# EAGLE design AudioMega HaGeHa DIL v101 (EAGLE 6.3)
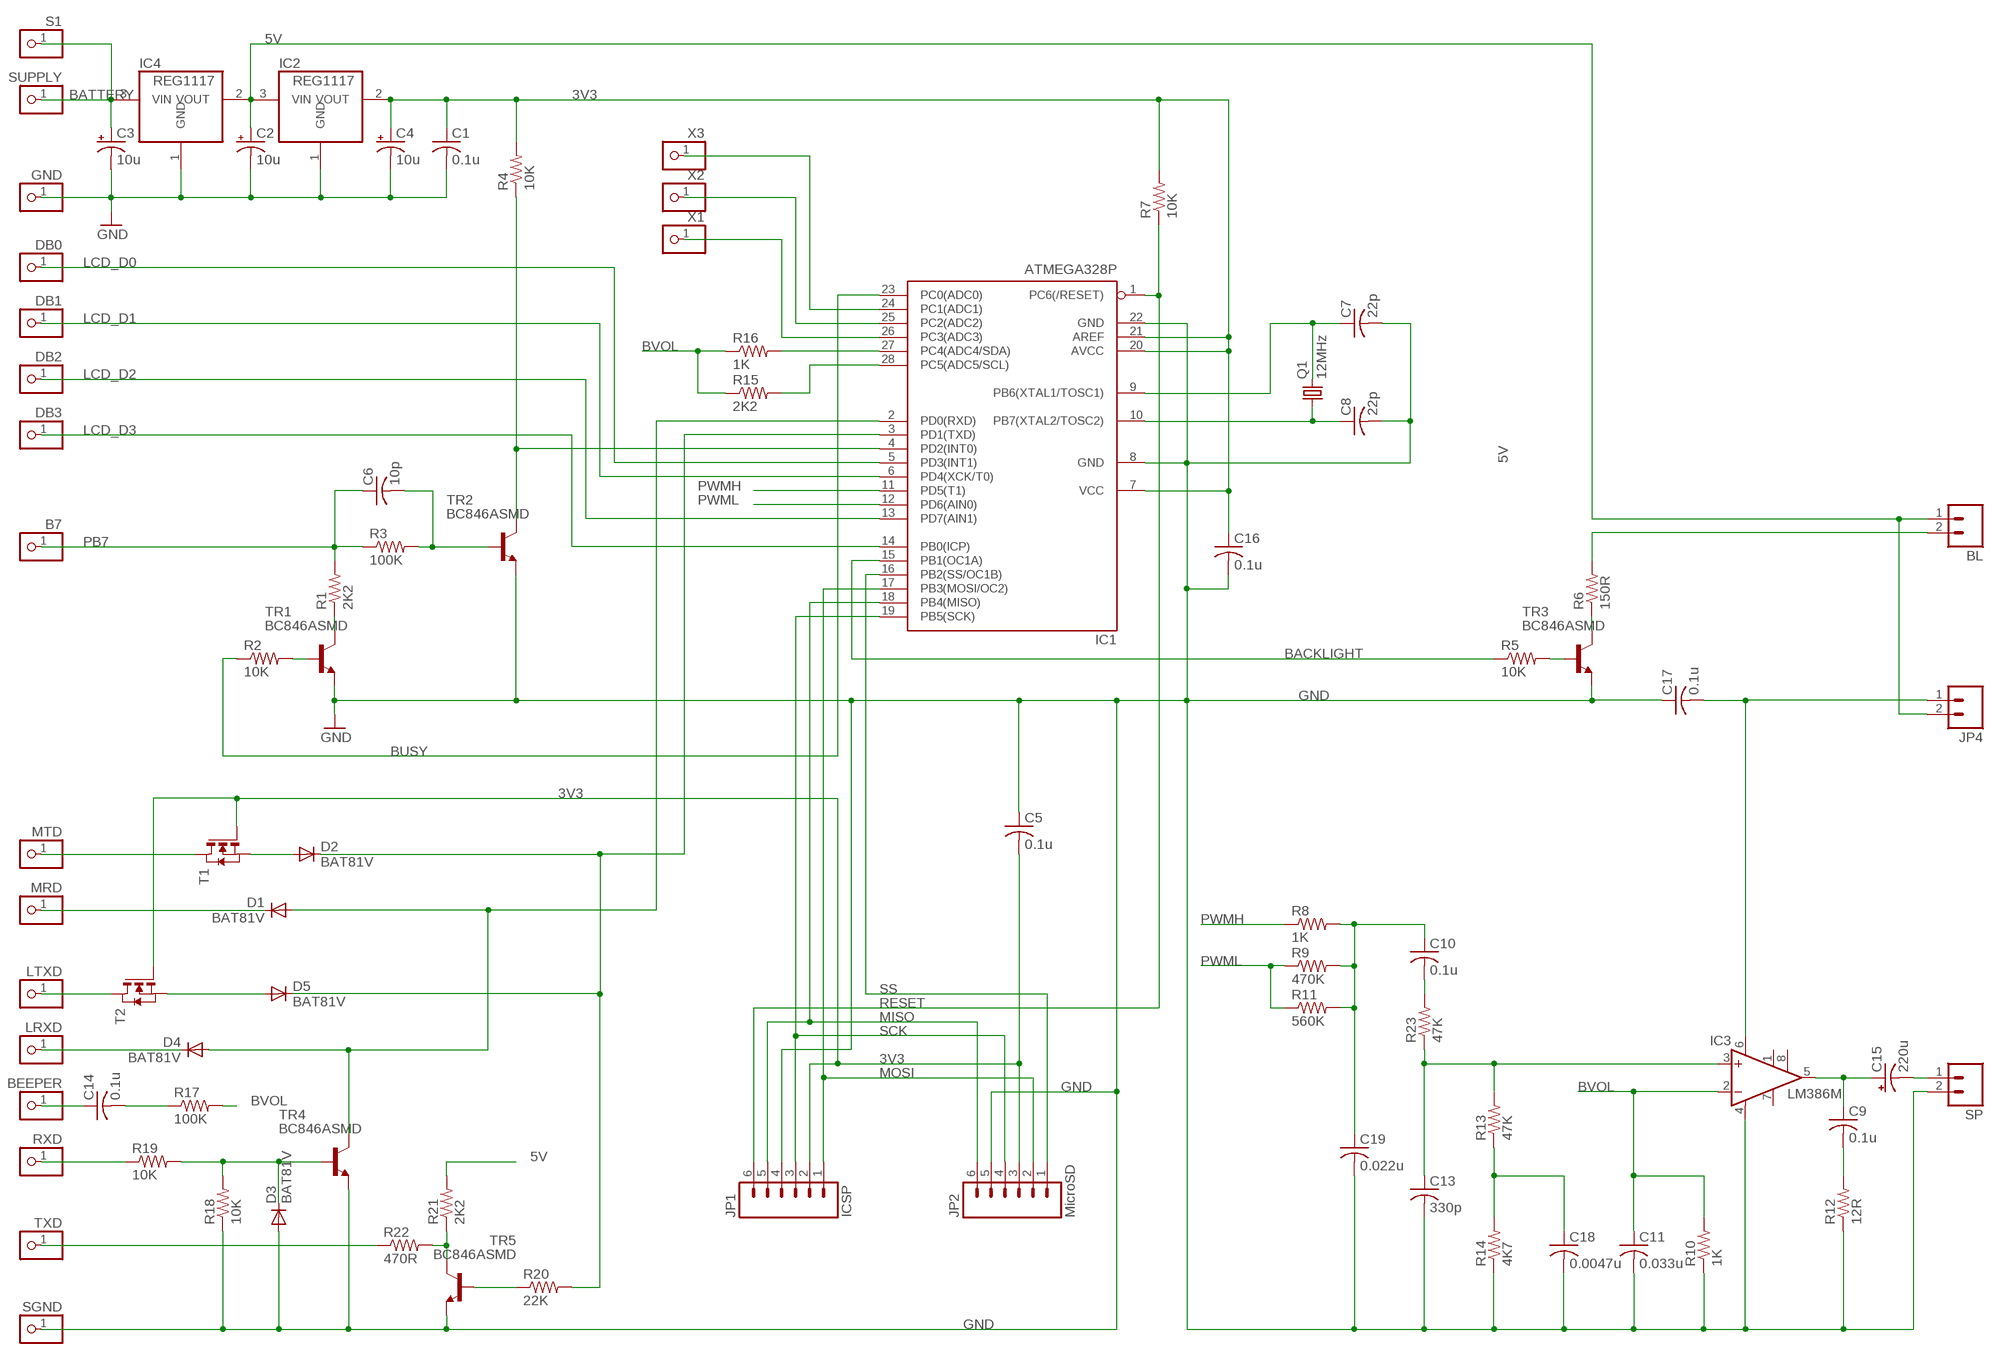
[diagram p0: schematic, sheet 1]

## Parts
B7  PINHD-1X1  [1X01]
BEEPER  PINHD-1X1  [1X01]
BL  M02PTH  [1X02]
C1  0.1u  C-USC1206  [C1206]
C2  10u  CPOL-USA/3216-18R  [A/3216-18R]
C3  10u  CPOL-USA/3216-18R  [A/3216-18R]
C4  10u  CPOL-USA/3216-18R  [A/3216-18R]
C5  0.1u  C-USC1206  [C1206]
C6  10p  C-USC1206  [C1206]
C7  22p  C-USC1206  [C1206]
C8  22p  C-USC1206  [C1206]
C9  0.1u  C-USC1206  [C1206]
C10  0.1u  C-USC1206  [C1206]
C11  0.033u  C-USC1206  [C1206]
C13  330p  C-USC1206  [C1206]
C14  0.1u  C-USC1206  [C1206]
C15  220u  CPOL-USCT7343  [CT7343]
C16  0.1u  C-USC1206  [C1206]
C17  0.1u  C-USC1206  [C1206]
C18  0.0047u  C-USC1206  [C1206]
C19  0.022u  C-USC1206  [C1206]
D1  BAT81V  DIODE-SOD123  [SOD123]
D2  BAT81V  DIODE-SOD123  [SOD123]
D3  BAT81V  DIODE-SOD123  [SOD123]
D4  BAT81V  DIODE-SOD123  [SOD123]
D5  BAT81V  DIODE-SOD123  [SOD123]
DB0  PINHD-1X1  [1X01]
DB1  PINHD-1X1  [1X01]
DB2  PINHD-1X1  [1X01]
DB3  PINHD-1X1  [1X01]
GND  PINHD-1X1  [1X01]
IC1  ATMEGA328P  MEGA8-P  [DIL28-3]
IC2  REG1117  [SOT223]
IC3  LM386M  LM386N-1  [DIL08]
IC4  REG1117  [SOT223]
JP1  ICSP  M06SIP  [1X06]
JP2  MicroSD  M06SIP  [1X06]
JP4  M02PTH  [1X02]
LRXD  PINHD-1X1  [1X01]
LTXD  PINHD-1X1  [1X01]
MRD  PINHD-1X1  [1X01]
MTD  PINHD-1X1  [1X01]
Q1  12MHz  CRYSTALHC49US  [HC49US]
R1  2K2  R-US_R1206  [R1206]
R2  10K  R-US_R1206  [R1206]
R3  100K  R-US_R1206  [R1206]
R4  10K  R-US_R1206  [R1206]
R5  10K  R-US_R1206  [R1206]
R6  150R  R-US_R1206  [R1206]
R7  10K  R-US_R1206  [R1206]
R8  1K  R-US_R1206  [R1206]
R9  470K  R-US_R1206  [R1206]
R10  1K  R-US_R1206  [R1206]
R11  560K  R-US_R1206  [R1206]
R12  12R  R-US_R1206  [R1206]
R13  47K  R-US_R1206  [R1206]
R14  4K7  R-US_R1206  [R1206]
R15  2K2  R-US_R1206  [R1206]
R16  1K  R-US_R1206  [R1206]
R17  100K  R-US_R1206  [R1206]
R18  10K  R-US_R1206  [R1206]
R19  10K  R-US_R1206  [R1206]
R20  22K  R-US_R1206  [R1206]
R21  2K2  R-US_R1206  [R1206]
R22  470R  R-US_R1206  [R1206]
R23  47K  R-US_R1206  [R1206]
RXD  PINHD-1X1  [1X01]
S1  PINHD-1X1  [1X01]
SGND  PINHD-1X1  [1X01]
SP  M02PTH  [1X02]
SUPPLY  PINHD-1X1  [1X01]
T1  NMOSSOT23  [SOT-23]
T2  NMOSSOT23  [SOT-23]
TR1  BC846ASMD  [SOT23]
TR2  BC846ASMD  [SOT23]
TR3  BC846ASMD  [SOT23]
TR4  BC846ASMD  [SOT23]
TR5  BC846ASMD  [SOT23]
TXD  PINHD-1X1  [1X01]
X1  PINHD-1X1  [1X01]
X2  PINHD-1X1  [1X01]
X3  PINHD-1X1  [1X01]

## Nets
3V3: C1.1 C4.+ C5.2 C16.1 IC1.7(VCC) IC1.20(AVCC) IC1.21(AREF) IC2.2(VOUT) JP1.2 JP2.3 R4.2 R7.2 T1.3(G) T2.3(G)
5V: BL.1 C2.+ IC2.3(VIN) IC4.2(VOUT) JP4.2 R21.2
BACKLIGHT: IC1.15(PB1(OC1A)) R5.1
BATTERY: C3.+ IC4.3(VIN) S1.1 SUPPLY.1
BUSY: IC1.23(PC0(ADC0)) R2.1
BVOL: C11.1 IC3.2(-IN) R10.2 R15.1 R16.1 R17.2
GND: C1.2 C2.- C3.- C4.- C5.1 C7.2 C8.2 C11.2 C13.2 C16.2 C17.1 C18.2 C19.2 D3.A GND.1 IC1.8(GND) IC1.22(GND) IC2.1(GND) IC3.4(GND) IC4.1(GND) JP1.4 JP2.5 R10.1 R12.1 R14.1 R18.1 SGND.1 SP.2 TR1.2(E) TR2.2(E) TR3.2(E) TR4.2(E) TR5.2(E)
LCD_D0: DB0.1 IC1.5(PD3(INT1))
LCD_D1: DB1.1 IC1.6(PD4(XCK/T0))
LCD_D2: DB2.1 IC1.13(PD7(AIN1))
LCD_D3: DB3.1 IC1.14(PB0(ICP))
MISO: IC1.18(PB4(MISO)) JP1.5 JP2.6
MOSI: IC1.17(PB3(MOSI/OC2)) JP1.1 JP2.2
N$2: R21.1 R22.2 TR5.3(C)
N$3: R22.1 TXD.1
N$4: R20.1 TR5.1(B)
N$5: IC1.28(PC5(ADC5/SCL)) R15.2
N$6: IC1.27(PC4(ADC4/SDA)) R16.2
N$7: IC1.26(PC3(ADC3)) X1.1
N$8: IC1.25(PC2(ADC2)) X2.1
N$9: IC1.24(PC1(ADC1)) X3.1
N$10: R19.1 RXD.1
N$11: D3.C R18.2 R19.2 TR4.1(B)
N$12: D4.C LRXD.1
N$14: D5.A T2.2(S)
N$15: D2.A T1.2(S)
N$16: MTD.1 T1.1(D)
N$17: LTXD.1 T2.1(D)
N$18: D1.C MRD.1
N$21: R1.1 TR1.3(C)
N$22: R2.2 TR1.1(B)
N$23: C6.2 R3.2 TR2.1(B)
N$24: BEEPER.1 C14.1
N$25: C14.2 R17.1
N$26: R5.2 TR3.1(B)
N$27: R6.1 TR3.3(C)
N$28: C10.2 R23.2
N$29: IC1.4(PD2(INT0)) R4.1 TR2.3(C)
N$30: C8.1 IC1.10(PB7(XTAL2/TOSC2)) Q1.1
N$31: C7.1 IC1.9(PB6(XTAL1/TOSC1)) Q1.2
N$33: BL.2 R6.2
N$34: C9.1 C15.+ IC3.5(OUT)
N$35: C9.2 R12.2
N$36: C15.- SP.1
N$37: C17.2 IC3.6(VS) JP4.1
N$38: C13.1 IC3.3(+IN) R13.2 R23.1
N$39: C10.1 C19.1 R8.2 R9.2 R11.2
N$40: C18.1 R13.1 R14.2
PB7: B7.1 C6.1 R1.2 R3.1
PWMH: IC1.11(PD5(T1)) R8.1
PWML: IC1.12(PD6(AIN0)) R9.1 R11.1
RESET: IC1.1(PC6(/RESET)) JP1.6 R7.1
RXD: D1.A D4.A IC1.2(PD0(RXD)) TR4.3(C)
SCK: IC1.19(PB5(SCK)) JP1.3 JP2.4
SS: IC1.16(PB2(SS/OC1B)) JP2.1
TXD: D2.C D5.C IC1.3(PD1(TXD)) R20.2
Unconnected: IC3.1(GAIN) IC3.7(BYPASS) IC3.8(GAIN)

## Library data of the parts
B7 BEEPER DB0 DB1-DB3 GND LRXD LTXD MRD MTD RXD S1 SGND SUPPLY TXD X1-X3 = pinhead:PINHD-1X1: PIN HEADER
BL JP4 SP = SparkFun-Connectors:M02: Header 2 Standard 2-pin 0.1" header. Use with straight break away headers (SKU : PRT-00116), right angle break away headers (PRT-00553), swiss pins (PRT-00743), machine pins (PRT-00117), and female headers (PRT-00115). Molex polarized connector foot print use with SKU : PRT-08233 with associated crimp pins and housings.
C1 C5-C11 C13 C14 C16-C19 = rcl:C-US: CAPACITOR, American symbol
C2-C4 C15 = rcl:CPOL-US: POLARIZED CAPACITOR, American symbol
D1-D5 = diode:DIODE-: DIODE
IC1 = atmel:MEGA8-P: MICROCONTROLLER 8 Kbytes FLASH, 1 kbytes SRAM, 512 bytes EEPROM, USART, 4-channel 10 bit ADC, 2-channel 8 bit ADC Pin compatible with Atmega48, ATMega88, ATMega168 Source: avr.lbr; OC_FARNELL: unknown; OC_NEWARK: unknown
IC2 IC4 = burr-brown:REG1117: 800mA and 1A Low Dropout (LDO) Positive Regulator 1.8V, 2.5V, 2.85V, 3.3V, 5V, and Adj; MPN: REG1117; OC_FARNELL: 1097566; OC_NEWARK: 14P6981
IC3 = linear:LM386?-*: Low Voltage Audio Power Amplifier Source: http://cache.national.com/ds/LM/LM386.pdf
JP1 JP2 = SparkFun-Connectors:M06: Header 6 Standard 6-pin 0.1" header. Use with straight break away headers (SKU : PRT-00116), right angle break away headers (PRT-00553), swiss pins (PRT-00743), machine pins (PRT-00117), and female headers (PRT-00115). Molex polarized connector foot print use with SKU : PRT-08094 with associated crimp pins and housings. NOTES ON THE VARIANTS LOCK and LOCK_LONGPADS... This footprint was designed to help hold the alignment of a through-hole component (i.e. 6-pin header) while soldering it into place. You may notice that each hole has been shifted either up or down by 0.005 of an inch from it's more standard position (which is a perfectly straight line). This slight alteration caused the pins (the squares in the middle) to touch the edges of the holes. Because they are alternating, it causes a "brace" to hold the component in place. 0.005 has proven to be the perfect amount of "off-center" position when using our standard breakaway headers. Although looks a little odd when you look at the bare footprint, once you have a header in there, the alteration is very hard to notice. Also, if you push a header all the way into place, it is covered up entirely on the bottom side. This idea of altering the position of holes to aid alignment will be further integrated into the Sparkfun Library for other footprints. It can help hold any component with 3 or more connection pins.
Q1 = SparkFun-FreqCtrl:CRYSTAL: Various standard crystals. Proven footprints. Spark Fun Electronics SKU : COM-00534
R1-R23 = rcl:R-US_: RESISTOR, American symbol
T1 T2 = zetex:NMOSSOT23: MOS FET; OC_FARNELL: unknown; OC_NEWARK: unknown
TR1-TR5 = transistor-npn:BC846*: NPN Transistor

## Board
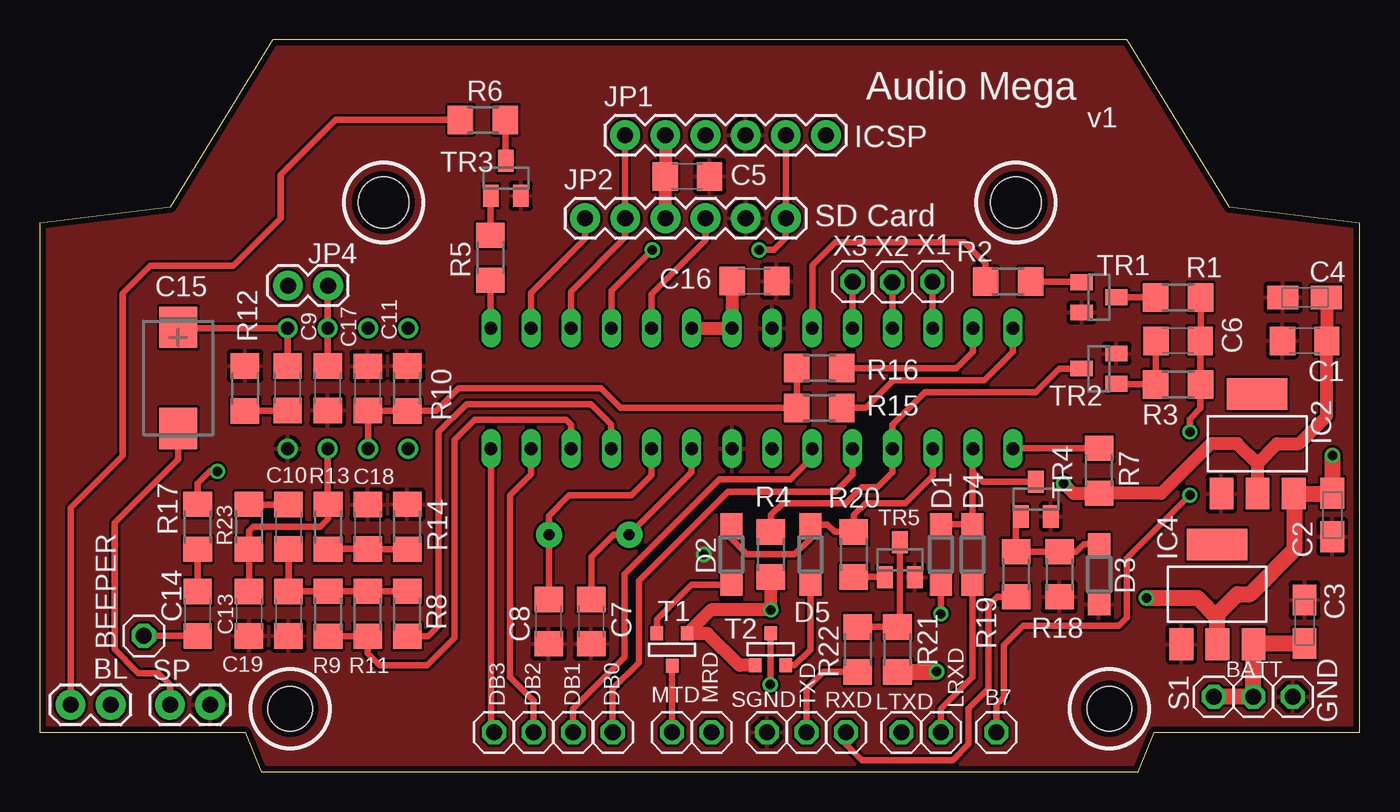
[diagram p1: board, top side]
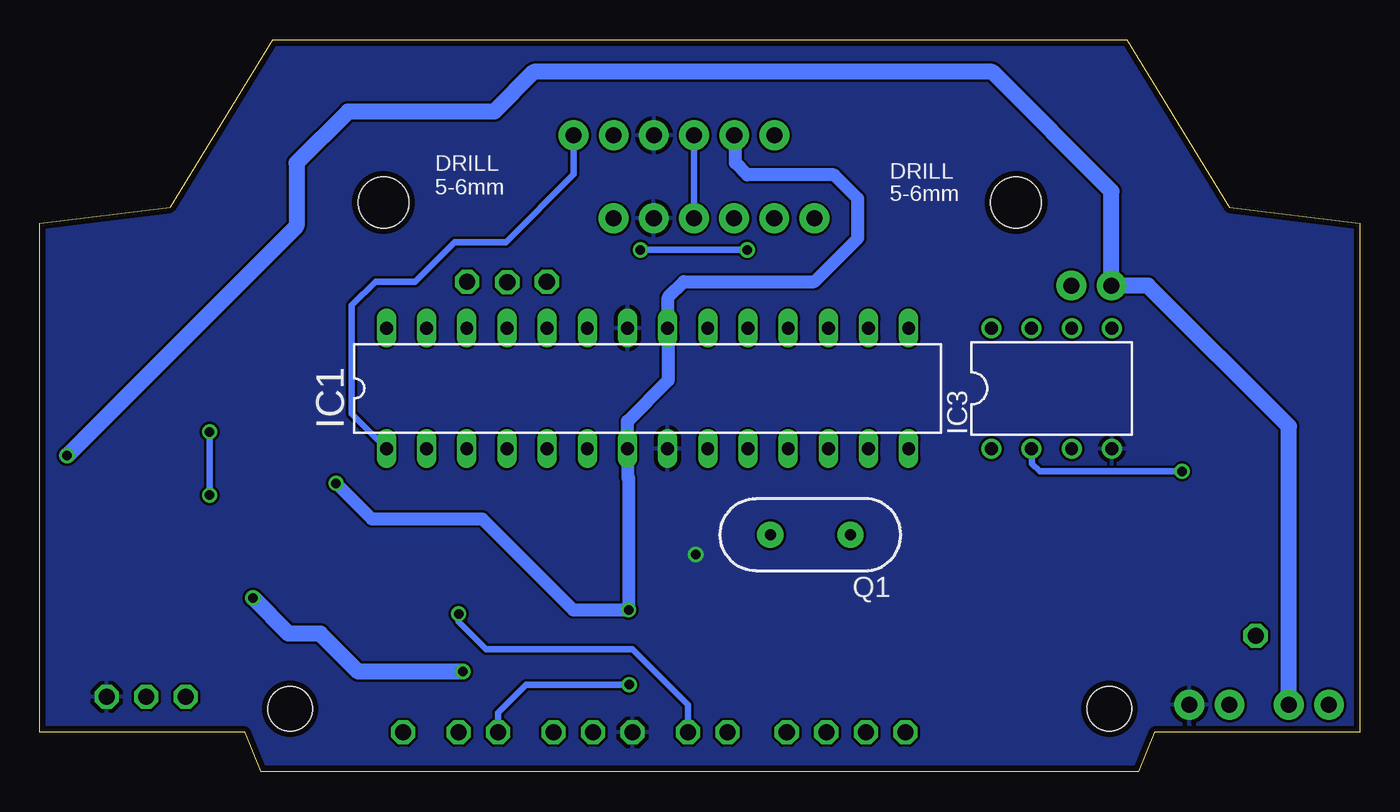
[diagram p2: board, bottom side, seen from below]

Size 83.5 x 46.3 mm. Coordinates in mm from the lower left corner, seen from the top.
Outline: 0,2.5 13,2.5 14,0 69.5,0 70.5,2.5 83.5,2.5 83.5,34.7 75.25,35.7 68.75,46.3 14.75,46.3 8.25,35.7 0,34.7 0,2.5
Copper layers (1*16): Top 0.0356mm / dielectric 1.5011mm / Bottom 0.0356mm
Design rules "LaenPCBOrder *": minimum track width 6mil, minimum drill 13mil, track to track 6mil, track to pad 6mil, pad to pad 6mil, via to via 6mil, smd to smd 6mil, copper to edge 15mil, drill to drill 6mil, minimum pad ring 7mil, minimum via ring 7mil, stop-mask expansion 4mil, vias tented up to drill 24mil, thermal gap 10mil
Holes 2.8 mm at 15.85,4 67.65,4
Holes 3.2 mm at 21.75,36 61.75,36
tKeepout: area 12.8,1 to 18.9,7; area 64.7,1 to 70.7,7; area 18.8,33 to 24.8,39; area 58.8,33 to 64.8,39

### Footprints (pad centres in the part's own frame; a part is rotated, then mirrored left to right if it is on the bottom)
1X01 = drill 1.016 octagon: 1 0,0
1X02 = drill 1.016 pad 1.88: 1 0,0; 2 2.54,0
C1206 = smd 1.6 x 1.8: 1 -1.4,0; 2 1.4,0
A/3216-18R = smd 1.95 x 1.5: + 1.375,0; - -1.375,0
CT7343 = smd 2.6 x 2.4: + -3.2,0; - 3.2,0
SOD123 = smd 1.4 x 1.4: A 1.9,0; C -1.9,0
DIL28-3 = drill 0.813 long: 1 -16.51,-3.81; 2 -13.97,-3.81; 3 -11.43,-3.81; 4 -8.89,-3.81; 5 -6.35,-3.81; 6 -3.81,-3.81; 7 -1.27,-3.81; 8 1.27,-3.81; 9 3.81,-3.81; 10 6.35,-3.81; 11 8.89,-3.81; 12 11.43,-3.81; 13 13.97,-3.81; 14 16.51,-3.81; 15 16.51,3.81; 16 13.97,3.81; 17 11.43,3.81; 18 8.89,3.81; 19 6.35,3.81; 20 3.81,3.81; 21 1.27,3.81; 22 -1.27,3.81; 23 -3.81,3.81; 24 -6.35,3.81; 25 -8.89,3.81; 26 -11.43,3.81; 27 -13.97,3.81; 28 -16.51,3.81
SOT223 = smd 1.499 x 2.007: 1 -2.261,-3.15; 2 0.025,-3.15; 3 2.311,-3.15 | smd 3.81 x 2.007: 4 0,3.15
DIL08 = drill 0.813 pad 1.27: 1 -3.81,-3.81; 2 -1.27,-3.81; 3 1.27,-3.81; 4 3.81,-3.81; 5 3.81,3.81; 6 1.27,3.81; 7 -1.27,3.81; 8 -3.81,3.81
1X06 = drill 1.016 pad 1.88: 1 0,0; 2 2.54,0; 3 5.08,0; 4 7.62,0; 5 10.16,0; 6 12.7,0
HC49US = drill 0.7 pad 1.651: 1 -2.54,0; 2 2.54,0
R1206 = smd 1.6 x 1.803: 1 -1.422,0; 2 1.422,0
SOT-23 = smd 0.787 x 0.889: 1 0.025,-1.016; 2 -0.94,1.016; 3 0.991,1.016
SOT23 = smd 1 x 1.4: 1 -0.95,-1.1; 2 0.95,-1.1; 3 0,1.1

### Placement (x,y rotation side)
B7  60.5,2.5 0 top
BEEPER  6.6,8.6 0 top
BL  4.5,4.25 180 top
C1  80,27.25 180 top
C2  81.75,16.25 90 top
C3  80,9.5 270 top
C4  80,30 0 top
C5  40.97,37.65 180 top
C6  72,27.25 180 top
C7  34.89,9.51 270 top
C8  32.2,9.51 270 top
C9  15.69,24.26 270 top
C10  15.75,15.5 90 top
C11  20.75,24.25 90 top
C13  13.25,10 270 top
C14  10,10 90 top
C15  8.78,24.91 270 top
C16  45.21,31.03 0 top
C17  18.23,24.26 90 top
C18  20.75,15.5 90 top
C19  15.75,10 270 top
D1  57,13.75 90 top
D2  43.75,13.75 270 top
D3  67,12.5 270 top
D4  59,13.75 90 top
D5  48.75,13.75 270 top
DB0  36.25,2.5 0 top
DB1  33.75,2.5 0 top
DB2  31.25,2.5 0 top
DB3  28.75,2.5 0 top
GND  79.25,4.75 0 top
IC1  45.05,24.25 0 bottom
IC2  77,20.75 0 top
IC3  19.5,24.25 0 bottom
IC4  74.46,11.23 0 top
JP1  37.03,40.25 0 top
JP2  34.5,35 0 top
JP4  18.25,30.75 180 top
LRXD  57,2.5 0 top
LTXD  54.5,2.5 0 top
MRD  42.5,2.5 0 top
MTD  40,2.5 0 top
Q1  34.75,15 180 bottom
R1  72,30 0 top
R2  61.25,31 0 top
R3  72,24.5 180 top
R4  46.25,13.75 270 top
R5  28.52,32.51 90 top
R6  28.04,41.22 180 top
R7  66.99,19.04 270 top
R8  23.25,10 90 top
R9  18.25,10 90 top
R10  23.25,24.25 270 top
R11  20.75,10 90 top
R12  13,24.25 270 top
R13  18.25,15.5 90 top
R14  23.25,15.5 270 top
R15  49.31,23.01 0 top
R16  49.31,25.53 0 top
R17  10,15.5 90 top
R18  64.5,12.5 90 top
R19  61.75,12.5 90 top
R20  51.5,13.75 90 top
R21  54.25,7.75 270 top
R22  51.75,7.75 90 top
R23  13.25,15.5 90 top
RXD  51,2.5 0 top
S1  74.25,4.75 0 top
SGND  46,2.5 0 top
SP  8.25,4.25 0 top
SUPPLY  76.75,4.75 0 top
T1  39.98,7.74 0 top
T2  46.25,7.75 180 top
TR1  67,30 270 top
TR2  67,25.5 90 top
TR3  29.49,37.53 0 top
TR4  63,17.25 0 top
TR5  54.41,13.42 0 top
TXD  48.5,2.5 0 top
X1  56.47,31 0 top
X2  53.92,30.97 0 top
X3  51.42,31 0 top

### Tracks (layer width: path | path; a pad name or v marks a point on that pad's centre or on a via)
3V3  (via drill 0.6)
  Top 0.813: JP1.2 C5.2 JP2.3 | C4.+ 81.4,29.98 C1.1 81.4,22.49 79.66,20.75 78.25,20.75 77.03,19.52 IC2.2 77.03,19.48 75.75,20.75 74.07,20.75 70.94,17.62 R7.2 65.38,17.62 v64.75,18.25 | C16.1 43.75,30.97 43.78,30.94 IC1.21 IC1.20 | R4.2 v46.25,10.25 42.47,10.25 T1.3 42.25,8.75 44.27,6.73 T2.3
  Bottom 0.813: IC1.21 43.75,28.03 43.75,24.75 46.32,22.18 IC1.7 46.31,18.63 46.25,18.57 v46.25,10.25 49.75,10.25 55.5,16 62.5,16 v64.75,18.25 | 43.75,28.09 43.75,30 42.75,31 34.5,31 31.75,33.75 31.75,36.25 33.25,37.75 38.75,37.75 39.5,38.5 39.5,40.18 JP1.2
  Bottom 1.016: 43.75,28.09 IC1.21
5V  (via drill 0.6)
  Top 0.61: 74.23,10 74.48,9.75
  Top 1.016: IC4.2 74.48,9.75 | 74.48,9.75 74.48,9.98 75.75,11.25 76.55,11.25 79.37,14.07 79.37,17.54 IC2.3 81.72,17.6 C2.+ v81.75,20 | R21.2 56.71,6.33 v56.73,6.35 | v70,11 73.23,11 74.48,9.75
  Bottom 1.016: BL.1 4.5,21.84 13.4,30.74 JP4.2 15.71,36.71 23.25,44.25 52.25,44.25 54.75,41.75 64,41.75 67.25,38.5 67.25,34.5 v81.75,20 | v56.73,6.35 63.35,6.35 65.75,8.75 67.75,8.75 v70,11
BACKLIGHT
  Top 0.406: R5.1 28.52,28.08 IC1.15
BATTERY
  Top 1.016: S1.1 SUPPLY.1 76.75,8.06 IC4.3 76.82,8.12 C3.+
BUSY
  Top 0.406: R2.1 59.83,32.17 58.5,33.5 50.34,33.5 48.88,32.04 48.88,28.08 IC1.23
BVOL  (via drill 0.6)
  Top 0.406: IC3.2 20.77,22.83 C11.1 23.23,22.85 R10.2 25.08,22.83 26.5,24.25 35.5,24.25 36.74,23.01 R15.1 R16.1 | v11.25,19 10.75,19 10,18.25 R17.2
  Bottom 0.406: v11.25,19 20.25,19 20.75,19.5 20.75,20.42 IC3.2
GND  (via drill 0.6)
  other vias: 42,13.75
  pour Top: 0,0 83.5,0 83.5,42.25 83.5,46.5 19,46.5 0,46.5
  pour Bottom: 0,0 83.5,0 83.5,12.75 83.5,46.25 23.25,46.25 0,46.25
LCD_D0
  Top 0.406: DB0.1 36.25,5.25 37.91,6.91 37.91,12.08 43.54,17.71 50.33,17.71 51.4,18.78 IC1.5
LCD_D1
  Top 0.406: DB1.1 33.75,4 37,7.25 37,12.5 43,18.5 47.5,18.5 48.86,19.86 IC1.6
LCD_D2
  Top 0.406: IC1.13 31.08,18.83 29.75,17.5 29.75,6 31.25,4.5 DB2.1
LCD_D3
  Top 0.406: IC1.14 28.54,2.71 DB3.1
MISO  (via drill 0.6)
  Top 0.406: JP1.5 JP2.6 47.18,34.98 47.18,33.73 46.45,33 v45.5,33 | v38.75,33 36.16,30.41 IC1.18
  Bottom 0.406: v45.5,33 v38.75,33
MOSI
  Top 0.406: JP1.1 JP2.2 37.04,33.79 33.62,30.37 IC1.17
N$2
  Top 0.406: R22.2 R21.1 54.41,9.33 TR5.3
N$3
  Top 0.406: R22.1 49.58,6.33 48.5,5.25 TXD.1
N$4
  Top 0.406: R20.1 TR5.1
N$5
  Top 0.406: R15.2 52.26,23.01 54,24.75 59.74,24.75 61.56,26.57 IC1.28
N$6
  Top 0.406: R16.2 57.98,25.53 59.02,26.57 IC1.27
N$7
  Top 0.406: X1.1 IC1.26
N$8
  Top 0.406: X2.1 53.92,28.08 IC1.25
N$9
  Top 0.406: X3.1 51.42,28.08 IC1.24
N$10
  Top 0.406: R19.1 60.58,11.08 60,10.5 60,5.25 58.75,4 58.75,1.75 57.75,0.75 52,0.75 51,1.75 RXD.1
N$11
  Top 0.406: TR4.1 61.75,15.85 R19.2 R18.2 65.57,13.92 66.04,14.39 D3.C
N$12
  Top 0.406: LRXD.1 57,4 59,6 D4.C
N$14
  Top 0.406: T2.2 47.75,6.73 48.74,7.72 D5.A
N$15
  Top 0.406: D2.A 41.22,11.84 39.05,9.67 T1.2
N$16
  Top 0.406: T1.1 MTD.1
N$17  (via drill 0.6)
  Top 0.406: T2.1 46.23,5.54 v46.21,5.52
  Bottom 0.406: v46.21,5.52 52.73,5.52 54.5,3.75 LTXD.1
N$18  (via drill 0.6)
  Top 0.406: v57,10 D1.C
  Bottom 0.406: MRD.1 42.5,4.25 46,7.75 55.25,7.75 57,9.5 v57,10
N$21
  Top 0.406: TR1.3 R1.1
N$22
  Top 0.406: R2.2 65.85,31 TR1.1
N$23
  Top 0.406: C6.2 70.6,24.52 R3.2 68.15,24.5 TR2.1
N$24
  Top 0.406: C14.1 BEEPER.1
N$25
  Top 0.406: C14.2 R17.1
N$26
  Top 0.406: R5.2 28.52,36.41 TR3.1
N$27
  Top 0.406: TR3.3 29.46,38.66 R6.1
N$28
  Top 0.406: C10.2 13.27,16.9 R23.2
N$29
  Top 0.406: TR2.3 64.5,25.5 63,24 56,24 53.94,21.94 IC1.4 53.94,18.94 53,18 52,18 51,17 47,17 46.25,16.25 R4.1
N$30
  Top 0.406: C8.1 Q1.1 32.21,16.21 33.5,17.5 37.43,17.5 38.7,18.77 IC1.10
N$31
  Top 0.406: C7.1 34.91,10.93 34.91,13.61 36.3,15 Q1.2 41.24,18.95 IC1.9
N$33
  Top 0.406: BL.2 1.96,16.71 5.25,20 5.25,30.25 7,32 12.25,32 15.25,35 15.25,37.75 18.72,41.22 R6.2
N$34
  Top 0.406: C9.1 IC3.5 8.83,28.06 C15.+
N$35
  Top 0.406: R12.2 15.66,22.83 C9.2
N$36
  Top 0.406: C15.- 8.78,19.78 4.75,15.75 4.75,7.75 6.25,6.25 7.5,6.25 8.25,5.5 SP.1
N$37
  Top 0.406: C17.2 IC3.6 18.23,30.73 JP4.1
N$38
  Top 0.406: C13.1 R23.1 13.25,15.25 13.5,15.5 17.75,15.5 18.25,16 R13.2 18.23,16.94 IC3.3
N$39
  Top 0.406: R8.2 R11.2 R9.2 15.77,11.42 C19.1 C10.1
N$40
  Top 0.406: R14.2 20.77,14.08 C18.1 18.27,14.1 R13.1
PB7  (via drill 0.6)
  Top 0.406: R1.2 73.42,27.27 C6.1 73.4,24.52 R3.1 73.42,22.98 72.75,22.31 v72.75,21.5 | v72.75,17.5 68.75,13.5 68.75,9.75 68.25,9.25 62.22,9.25 60.99,8.02 60.99,4.76 61,4.75 60.5,4.25 B7.1
  Bottom 0.406: v72.75,17.5 v72.75,21.5
PWMH
  Top 0.406: R8.1 24.58,8.58 25.25,9.25 25.25,21.5 27,23.25 34.88,23.25 36.15,21.98 IC1.11
PWML
  Top 0.406: R9.1 R11.1 20.75,7.5 21.5,6.75 24.5,6.75 26.25,8.5 26.25,21 27.5,22.25 33.3,22.25 33.61,21.94 IC1.12
RESET
  Top 0.406: R7.1 61.58,20.46 IC1.1
  Bottom 0.406: JP1.6 49.73,37.77 54,33.5 57.25,33.5 59.75,31 62.25,31 63.75,29.5 63.75,22.63 IC1.1
RXD
  Top 0.406: D1.A D4.A 59,19 | TR4.3 59.65,18.35 59,19 | 59,19 59,20.42 IC1.2
SCK
  Top 0.406: IC1.19 38.7,30.2 42.12,33.62 JP2.4
  Bottom 0.406: JP2.4 JP1.3
SS
  Top 0.406: IC1.16 31.08,30.3 34.5,33.72 JP2.1
TXD
  Top 0.406: IC1.3 56.48,18.71 54.77,17 52.25,17 51.5,16.25 R20.2 50.3,15.17 49.83,15.64 D5.C 48.75,14.75 47.75,13.75 44.75,13.75 43.75,14.75 D2.C

### Text on the board
tNames: Audio Mega | v1 | ICSP | SD Card | BATT
bNames: DRILL | DRILL | 5-6mm | 5-6mm